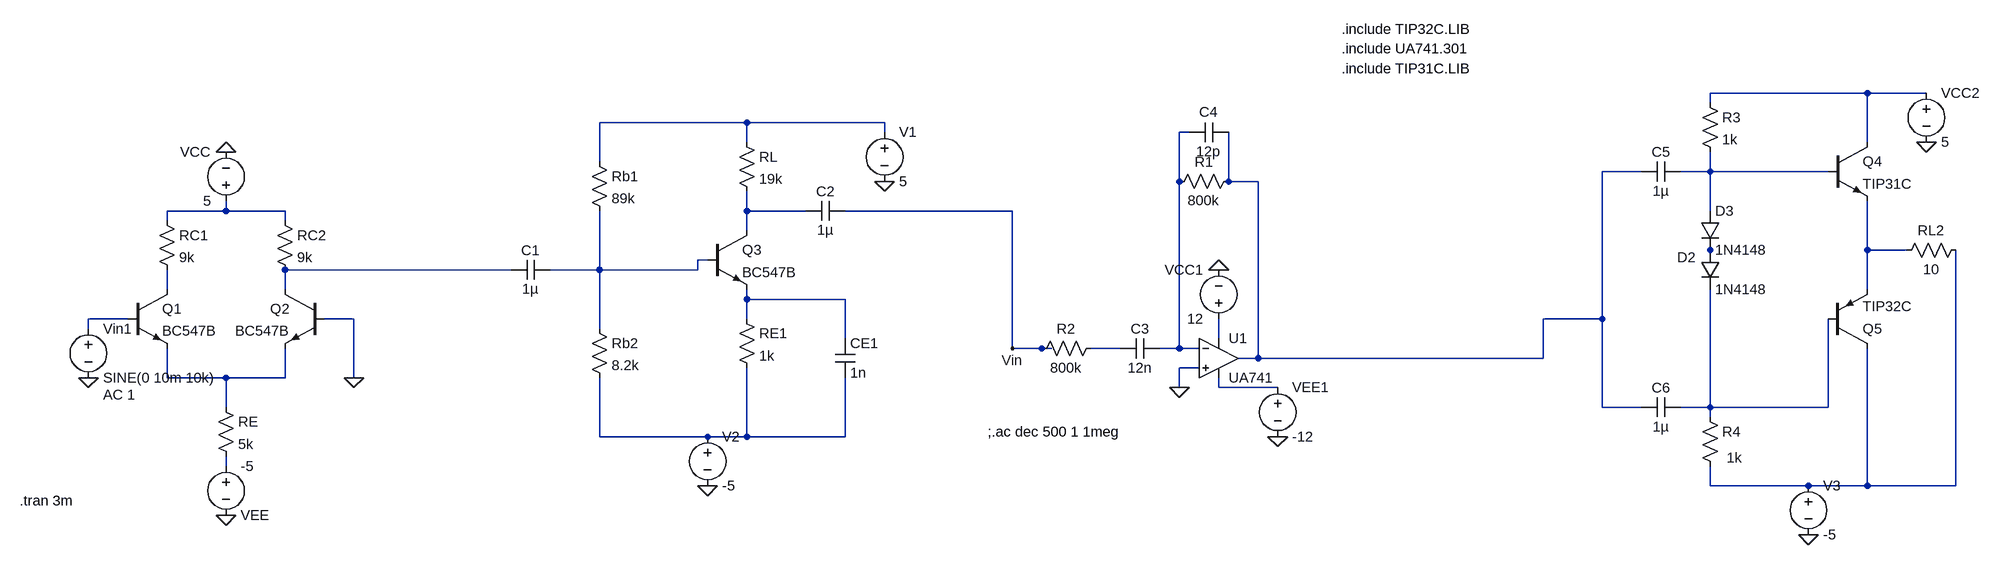
[diagram p0: schematic test.asc]
test.asc, the LTspice schematic file:
Version 4
SHEET 1 3096 1108
WIRE 2864 -128 2608 -128
WIRE 2960 -128 2864 -128
WIRE 2608 -112 2608 -128
WIRE 1040 -80 800 -80
WIRE 1264 -80 1040 -80
WIRE 1264 -64 1264 -80
WIRE 1760 -64 1744 -64
WIRE 1040 -48 1040 -80
WIRE 2864 -48 2864 -128
WIRE 800 -16 800 -80
WIRE 2496 0 2432 0
WIRE 2608 0 2608 -32
WIRE 2608 0 2560 0
WIRE 2800 0 2608 0
WIRE 1744 16 1744 -64
WIRE 1824 16 1824 -64
WIRE 1872 16 1824 16
WIRE 192 64 192 48
WIRE 192 64 96 64
WIRE 288 64 192 64
WIRE 1040 64 1040 32
WIRE 1136 64 1040 64
WIRE 1472 64 1200 64
WIRE 2608 64 2608 0
WIRE 96 80 96 64
WIRE 288 80 288 64
WIRE 1040 96 1040 64
WIRE 2864 128 2864 48
WIRE 2928 128 2864 128
WIRE 976 144 960 144
WIRE 2608 144 2608 128
WIRE 656 160 288 160
WIRE 800 160 800 64
WIRE 800 160 720 160
WIRE 960 160 960 144
WIRE 960 160 800 160
WIRE 96 192 96 160
WIRE 288 192 288 160
WIRE 2864 192 2864 128
WIRE 1040 208 1040 192
WIRE 1200 208 1040 208
WIRE 32 240 -32 240
WIRE 400 240 352 240
WIRE 1040 240 1040 208
WIRE 2432 240 2432 0
WIRE 2432 240 2336 240
WIRE -32 256 -32 240
WIRE 800 256 800 160
WIRE 1200 272 1200 208
WIRE 1808 272 1808 240
WIRE 1472 288 1472 64
WIRE 1520 288 1472 288
WIRE 1536 288 1520 288
WIRE 1648 288 1600 288
WIRE 1744 288 1744 16
WIRE 1744 288 1712 288
WIRE 1776 288 1744 288
WIRE 1872 304 1872 16
WIRE 1872 304 1840 304
WIRE 2336 304 2336 240
WIRE 2336 304 1872 304
WIRE 1776 320 1744 320
WIRE 96 336 96 288
WIRE 192 336 96 336
WIRE 288 336 288 288
WIRE 288 336 192 336
WIRE 400 336 400 240
WIRE 1744 352 1744 320
WIRE 1808 352 1808 336
WIRE 1904 352 1808 352
WIRE 192 384 192 336
WIRE 2432 384 2432 240
WIRE 2496 384 2432 384
WIRE 2608 384 2608 192
WIRE 2608 384 2560 384
WIRE 2800 384 2800 240
WIRE 2800 384 2608 384
WIRE 2608 400 2608 384
WIRE 800 432 800 336
WIRE 976 432 800 432
WIRE 1040 432 1040 320
WIRE 1040 432 976 432
WIRE 1200 432 1200 336
WIRE 1200 432 1040 432
WIRE 192 480 192 464
WIRE 2608 512 2608 480
WIRE 2768 512 2608 512
WIRE 2864 512 2864 288
WIRE 2864 512 2768 512
WIRE 3008 512 3008 128
WIRE 3008 512 2864 512
FLAG 192 -32 0
FLAG -32 336 0
FLAG 400 336 0
FLAG 192 560 0
FLAG 1264 16 0
FLAG 976 512 0
FLAG 1744 352 0
FLAG 1472 288 Vin
FLAG 1808 160 0
FLAG 1904 432 0
FLAG 2960 -48 0
FLAG 2768 592 0
DATAFLAG 1040 -80 ""
SYMBOL res 80 64 R0
SYMATTR InstName RC1
SYMATTR Value 9k
SYMBOL res 272 64 R0
SYMATTR InstName RC2
SYMATTR Value 9k
SYMBOL npn 32 192 R0
SYMATTR InstName Q1
SYMATTR Value BC547B
SYMBOL npn 352 192 M0
SYMATTR InstName Q2
SYMATTR Value BC547B
SYMBOL res 176 368 R0
SYMATTR InstName RE
SYMATTR Value 5k
SYMBOL voltage 192 64 R180
WINDOW 0 24 96 Left 2
WINDOW 3 24 16 Left 2
WINDOW 123 0 0 Left 0
WINDOW 39 0 0 Left 0
SYMATTR InstName VCC
SYMATTR Value 5
SYMBOL voltage -32 240 R0
WINDOW 123 24 124 Left 2
WINDOW 39 0 0 Left 0
SYMATTR Value2 AC 1
SYMATTR InstName Vin1
SYMATTR Value SINE(0 10m 10k)
SYMBOL voltage 192 464 R0
WINDOW 0 24 96 Left 2
WINDOW 3 24 16 Left 2
WINDOW 123 0 0 Left 0
WINDOW 39 0 0 Left 0
SYMATTR InstName VEE
SYMATTR Value -5
SYMBOL cap 720 144 R90
WINDOW 0 0 32 VBottom 2
WINDOW 3 32 32 VTop 2
SYMATTR InstName C1
SYMATTR Value 1µ
SYMBOL res 784 -32 R0
SYMATTR InstName Rb1
SYMATTR Value 89k
SYMBOL res 784 240 R0
SYMATTR InstName Rb2
SYMATTR Value 8.2k
SYMBOL voltage 1264 -80 R0
WINDOW 123 0 0 Left 0
WINDOW 39 0 0 Left 0
SYMATTR InstName V1
SYMATTR Value 5
SYMBOL res 1024 -64 R0
SYMATTR InstName RL
SYMATTR Value 19k
SYMBOL npn 976 96 R0
SYMATTR InstName Q3
SYMATTR Value BC547B
SYMBOL res 1024 224 R0
SYMATTR InstName RE1
SYMATTR Value 1k
SYMBOL cap 1184 272 R0
SYMATTR InstName CE1
SYMATTR Value 1n
SYMBOL voltage 976 416 R0
WINDOW 123 0 0 Left 0
WINDOW 39 0 0 Left 0
SYMATTR InstName V2
SYMATTR Value -5
SYMBOL cap 1200 48 R90
WINDOW 0 0 32 VBottom 2
WINDOW 3 32 32 VTop 2
SYMATTR InstName C2
SYMATTR Value 1µ
SYMBOL cap 1712 272 R90
WINDOW 0 0 32 VBottom 2
WINDOW 3 32 32 VTop 2
SYMATTR InstName C3
SYMATTR Value 12n
SYMBOL res 1840 0 R90
WINDOW 0 0 56 VBottom 2
WINDOW 3 32 56 VTop 2
SYMATTR InstName R1
SYMATTR Value 800k
SYMBOL cap 1824 -80 R90
WINDOW 0 -1 32 VBottom 2
WINDOW 3 32 32 VTop 2
SYMATTR InstName C4
SYMATTR Value 12p
SYMBOL res 1616 272 R90
WINDOW 0 0 56 VBottom 2
WINDOW 3 32 56 VTop 2
SYMATTR InstName R2
SYMATTR Value 800k
SYMBOL voltage 1808 256 R180
WINDOW 0 24 96 Left 2
WINDOW 3 24 16 Left 2
WINDOW 123 0 0 Left 0
WINDOW 39 0 0 Left 0
SYMATTR InstName VCC1
SYMATTR Value 12
SYMBOL voltage 1904 336 R0
WINDOW 123 0 0 Left 0
WINDOW 39 0 0 Left 0
SYMATTR InstName VEE1
SYMATTR Value -12
SYMBOL res 2592 -128 R0
SYMATTR InstName R3
SYMATTR Value 1k
SYMBOL res 2592 384 R0
WINDOW 3 43 82 Left 2
SYMATTR Value 1k
SYMATTR InstName R4
SYMBOL res 3024 112 R90
WINDOW 0 0 56 VBottom 2
WINDOW 3 32 56 VTop 2
SYMATTR InstName RL2
SYMATTR Value 10
SYMBOL voltage 2960 -144 R0
WINDOW 123 0 0 Left 0
WINDOW 39 0 0 Left 0
SYMATTR InstName VCC2
SYMATTR Value 5
SYMBOL diode 2592 128 R0
WINDOW 0 -38 12 Left 2
SYMATTR InstName D2
SYMATTR Value 1N4148
SYMBOL diode 2592 64 R0
SYMATTR InstName D3
SYMATTR Value 1N4148
SYMBOL voltage 2768 496 R0
WINDOW 123 0 0 Left 0
WINDOW 39 0 0 Left 0
SYMATTR InstName V3
SYMATTR Value -5
SYMBOL cap 2560 -16 R90
WINDOW 0 0 32 VBottom 2
WINDOW 3 32 32 VTop 2
SYMATTR InstName C5
SYMATTR Value 1µ
SYMBOL cap 2560 368 R90
WINDOW 0 0 32 VBottom 2
WINDOW 3 32 32 VTop 2
SYMATTR InstName C6
SYMATTR Value 1µ
SYMBOL OpAmps\\opamp2 1808 240 R0
SYMATTR InstName U1
SYMATTR Value UA741
SYMBOL npn 2800 -48 R0
SYMATTR InstName Q4
SYMATTR Value TIP31C
SYMBOL pnp 2800 288 M180
SYMATTR InstName Q5
SYMATTR Value TIP32C
TEXT -144 536 Left 2 !.tran 3m
TEXT 1432 424 Left 2 !;.ac dec 500 1 1meg
TEXT 2008 -200 Left 2 !.include UA741.301
TEXT 2008 -232 Left 2 !.include TIP32C.LIB
TEXT 2008 -168 Left 2 !.include TIP31C.LIB

The netlist it stands for:
* test.asc
RC1 N006 N012 9k
RC2 N006 N011 9k
Q1 N012 N014 N017 0 BC547B
Q2 N011 0 N017 0 BC547B
RE N017 N021 5k
VCC N006 0 5
Vin1 N014 0 SINE(0 10m 10k) AC 1
VEE N021 0 -5
C1 N009 N011 1µ
Rb1 N002 N009 89k
Rb2 N009 N020 8.2k
V1 N002 0 5
RL N002 N007 19k
Q3 N007 N009 N013 0 BC547B
RE1 N013 N020 1k
CE1 N013 N020 1n
V2 N020 0 -5
C2 Vin N007 1µ
C3 N003 N016 12n
R1 N004 N003 800k
C4 N004 N003 12p
R2 N016 Vin 800k
VCC1 N015 0 12
VEE1 N018 0 -12
R3 N001 N005 1k
R4 N019 N022 1k
RL2 N022 N008 10
VCC2 N001 0 5
D2 N010 N019 1N4148
D3 N005 N010 1N4148
V3 N022 0 -5
C5 N005 N004 1µ
C6 N019 N004 1µ
XU1 0 N003 N015 N018 N004 UA741  ; pins In+ In- V+ V- OUT
Q4 N001 N005 N008 0 TIP31C
Q5 N022 N019 N008 0 TIP32C
.model D D
.lib standard.dio
.model NPN NPN
.model PNP PNP
.lib standard.bjt
.tran 3m
;.ac dec 500 1 1meg
.include UA741.301
.include TIP32C.LIB
.include TIP31C.LIB
.backanno
.end